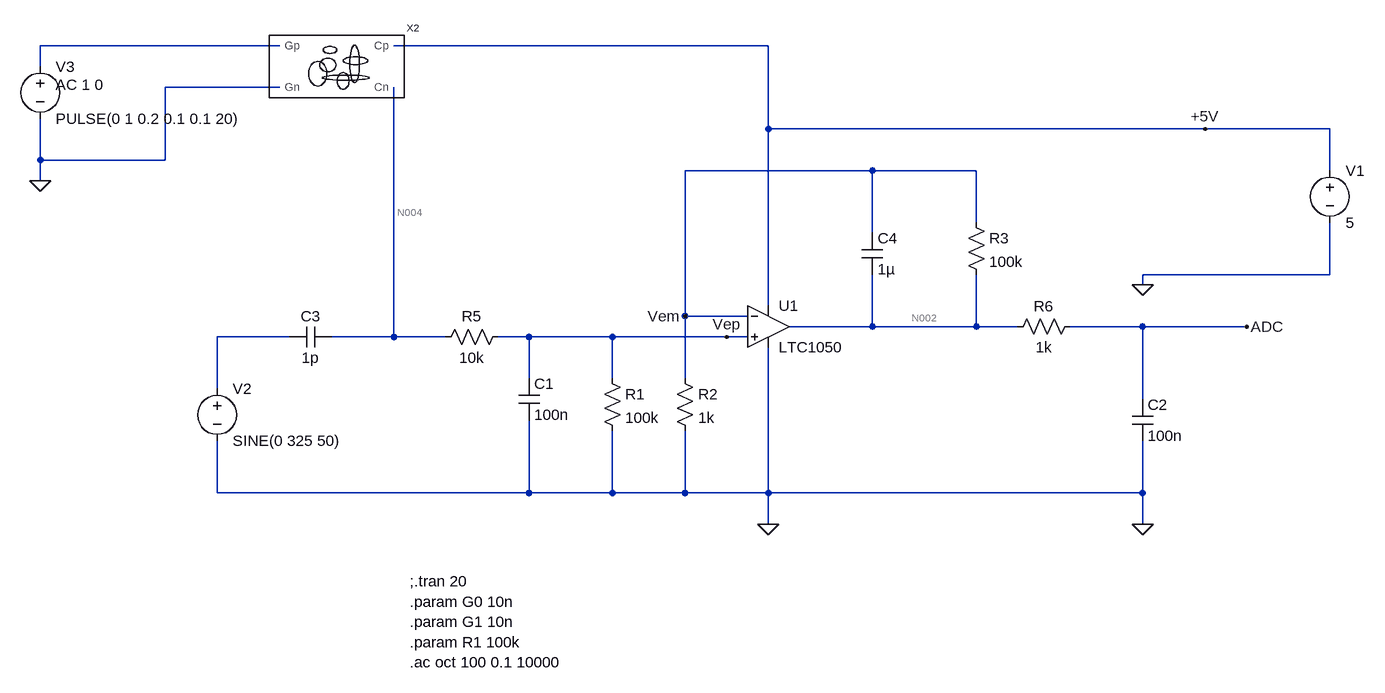
[diagram p0: schematic montage_test_capteur.asc]
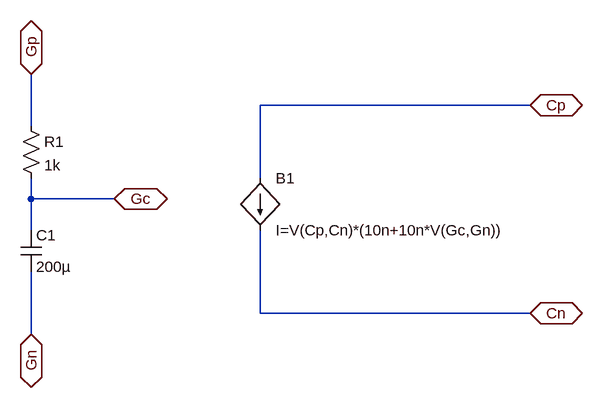
[diagram p1: sub-circuit capteur_graphique.asc]
montage_test_capteur.asc, the LTspice schematic file:
Version 4.1
SHEET 1 1432 680
WIRE -240 -384 -608 -384
WIRE 512 -384 -64 -384
WIRE -608 -352 -608 -384
WIRE -240 -320 -416 -320
WIRE 512 -256 512 -384
WIRE 1184 -256 512 -256
WIRE 1376 -256 1184 -256
WIRE -608 -208 -608 -272
WIRE -416 -208 -416 -320
WIRE -416 -208 -608 -208
WIRE 672 -192 384 -192
WIRE 832 -192 672 -192
WIRE 1376 -192 1376 -256
WIRE -608 -176 -608 -208
WIRE 832 -112 832 -192
WIRE 672 -96 672 -192
WIRE 1376 -32 1376 -112
WIRE 1376 -32 1088 -32
WIRE 1088 -16 1088 -32
WIRE 512 16 512 -256
WIRE 384 32 384 -192
WIRE 480 32 384 32
WIRE 672 48 672 -32
WIRE 672 48 544 48
WIRE 832 48 832 -32
WIRE 832 48 672 48
WIRE 896 48 832 48
WIRE 1088 48 976 48
WIRE 1248 48 1088 48
WIRE -224 64 -336 64
WIRE -64 64 -64 -320
WIRE -64 64 -160 64
WIRE 16 64 -64 64
WIRE 144 64 96 64
WIRE 272 64 144 64
WIRE 448 64 272 64
WIRE 480 64 448 64
WIRE 144 128 144 64
WIRE 272 128 272 64
WIRE 384 128 384 32
WIRE -336 144 -336 64
WIRE 1088 160 1088 48
WIRE -336 304 -336 224
WIRE 144 304 144 192
WIRE 144 304 -336 304
WIRE 272 304 272 208
WIRE 272 304 144 304
WIRE 384 304 384 208
WIRE 384 304 272 304
WIRE 512 304 512 80
WIRE 512 304 384 304
WIRE 1088 304 1088 224
WIRE 1088 304 512 304
WIRE 512 352 512 304
WIRE 1088 352 1088 304
FLAG 512 352 0
FLAG 1088 352 0
FLAG 1088 -16 0
FLAG 1248 48 ADC
FLAG 384 32 Vem
FLAG 448 64 Vep
FLAG 1184 -256 +5V
FLAG -608 -176 0
SYMBOL cap 128 128 R0
SYMATTR InstName C1
SYMATTR Value 100n
SYMBOL res 112 48 R90
WINDOW 0 0 56 VBottom 2
WINDOW 3 32 56 VTop 2
SYMATTR InstName R5
SYMATTR Value 10k
SYMBOL res 368 112 R0
SYMATTR InstName R2
SYMATTR Value 1k
SYMBOL res 256 112 R0
SYMATTR InstName R1
SYMATTR Value 100k
SYMBOL OpAmps\\LTC1050 512 -16 R0
SYMATTR InstName U1
SYMBOL cap 656 -96 R0
SYMATTR InstName C4
SYMATTR Value 1µ
SYMBOL res 816 -128 R0
SYMATTR InstName R3
SYMATTR Value 100k
SYMBOL res 992 32 R90
WINDOW 0 0 56 VBottom 2
WINDOW 3 32 56 VTop 2
SYMATTR InstName R6
SYMATTR Value 1k
SYMBOL cap 1072 160 R0
SYMATTR InstName C2
SYMATTR Value 100n
SYMBOL cap -160 48 R90
WINDOW 0 0 32 VBottom 2
WINDOW 3 32 32 VTop 2
SYMATTR InstName C3
SYMATTR Value 1p
SYMBOL voltage 1376 -208 R0
WINDOW 123 0 0 Left 0
WINDOW 39 0 0 Left 0
SYMATTR InstName V1
SYMATTR Value 5
SYMBOL voltage -608 -368 R0
WINDOW 123 24 44 Left 2
WINDOW 39 0 0 Left 0
SYMATTR Value2 AC 1 0
SYMATTR InstName V3
SYMATTR Value PULSE(0 1 0.2 0.1 0.1 20)
SYMBOL voltage -336 128 R0
WINDOW 123 0 0 Left 0
WINDOW 39 0 0 Left 0
SYMATTR InstName V2
SYMATTR Value SINE(0 325 50)
SYMBOL capteur_graphique -144 -352 R0
SYMATTR InstName X2
TEXT -40 440 Left 2 !;.tran 20\n.param G0 10n\n.param G1 10n\n.param R1 100k\n.ac oct 100 0.1 10000

capteur_graphique.asc, the sub-circuit schematic file:
Version 4
SHEET 1 880 680
WIRE 464 16 48 16
WIRE -304 48 -304 -32
WIRE 48 128 48 16
WIRE -304 160 -304 128
WIRE -176 160 -304 160
WIRE -304 208 -304 160
WIRE 48 336 48 208
WIRE 464 336 48 336
WIRE -304 368 -304 272
FLAG 464 336 Cn
IOPIN 464 336 BiDir
FLAG 464 16 Cp
IOPIN 464 16 BiDir
FLAG -304 -32 Gp
IOPIN -304 -32 BiDir
FLAG -176 160 Gc
IOPIN -176 160 BiDir
FLAG -304 368 Gn
IOPIN -304 368 BiDir
SYMBOL bi 48 128 R0
SYMATTR InstName B1
SYMATTR Value I=V(Cp,Cn)*(10n+10n*V(Gc,Gn))
SYMBOL res -320 32 R0
SYMATTR InstName R1
SYMATTR Value 1k
SYMBOL cap -320 208 R0
SYMATTR InstName C1
SYMATTR Value 200µ

The netlist it stands for:
* montage_test_capteur.asc
C1 Vep 0 100n
R5 Vep N004 10k
R2 Vem 0 1k
R1 Vep 0 100k
X§U1 Vep Vem +5V 0 N002 LTC1050  ; pins In+ In- V+ V- OUT
C4 Vem N002 1µ
R3 Vem N002 100k
R6 ADC N002 1k
C2 ADC 0 100n
C3 N004 N003 1p
V1 +5V 0 5
V3 N001 0 PULSE(0 1 0.2 0.1 0.1 20) AC 1 0
V2 N003 0 SINE(0 325 50)
X§X2 +5V N004 N001 0 capteur_graphique

* block symbol definitions
.subckt capteur_graphique Cp Cn Gp Gn
B1 Cp Cn I=V(Cp,Cn)*(10n+10n*V(Gc,Gn))
R1 Gp Gc 1k
C1 Gc Gn 200µ
.ends capteur_graphique

;.tran 20
.param G0 10n
.param G1 10n
.param R1 100k
.ac oct 100 0.1 10000
.lib LTC.lib
.backanno
.end

* Results of the author's LTspice run, read from the files saved beside the schematic
* Operating Point, zero values left out:
*   V(n004) = 5.494 mV
*   V(+5v) = 5 V
*   V(n002) = 504.4 mV
*   V(vep) = 4.995 mV
*   V(vem) = 4.995 mV
*   V(adc) = 504.4 mV
*   I(R2) = 4.995 µA
*   I(V1) = -754.2 µA
*   I(R5) = -49.95 nA
*   I(R3) = -4.995 µA
*   I(R1) = 49.95 nA
*   Ix(x2:cp) = 49.95 nA
*   Ix(x2:cn) = -49.95 nA
*   Ix(u1:3) = 754.1 µA
*   Ix(u1:4) = -749.1 µA
*   Ix(u1:5) = -4.995 µA
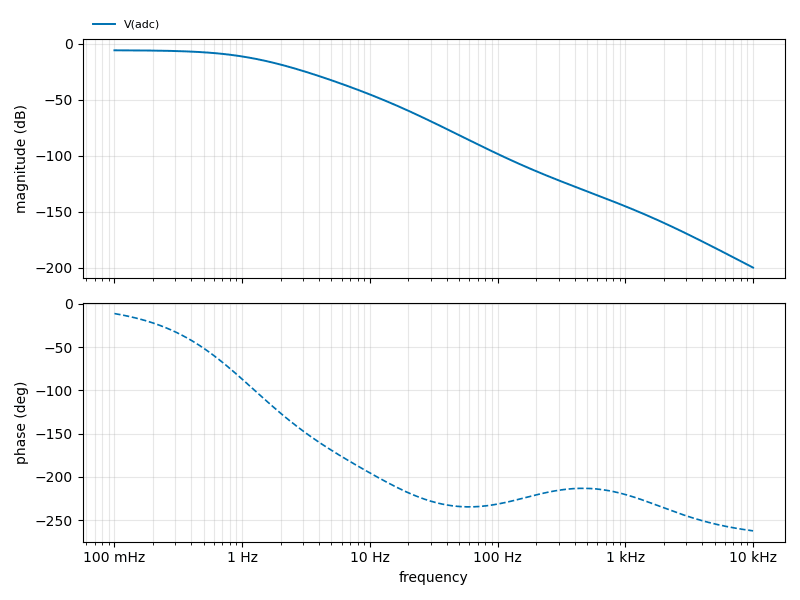
[diagram p2: AC Analysis of montage_test_capteur.asc, plotted from the saved traces]
* AC Analysis, 1 run:
*   V(adc): -6.04 dB at 100 mHz, -200.05 dB at 10 kHz, peak -6.04 dB at 100 mHz, 3 dB below the peak at 677.1 mHz